# Altium schematic sheet lesson10.SchDoc
size A4
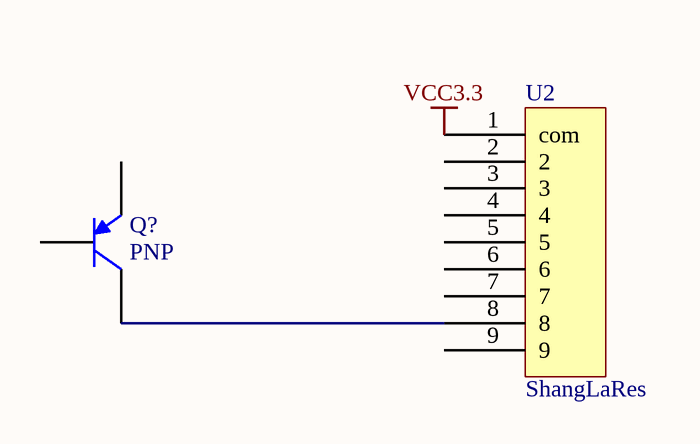
[diagram p0: lesson10.SchDoc]

## Parts
Q?  PNP  [SOT-23B]
U2  ShangLaRes  [shangla]

## Nets
VCC3.3: U2.1(com)
NetQ?_1: Q?.1(C) U2.8

Not connected (* = marked no-connect by the designer): Q? 2(B) 3(E); U2 2 3 4 5 6 7 9

## Library data of the parts
Q? = PNP: PNP Bipolar Transistor; Published: 8-Jun-2000; LatestRevisionDate: 17-Jul-2002; LatestRevisionNote: Re-released for DXP Platform.; PackageReference: SOT-23B; Publisher: Altium Limited; Code_JEDEC: SOT-23